# Altium schematic sheet Main.SchDoc
size C; DocumentNumber: 1; SheetNumber: 1; SheetTotal: 8
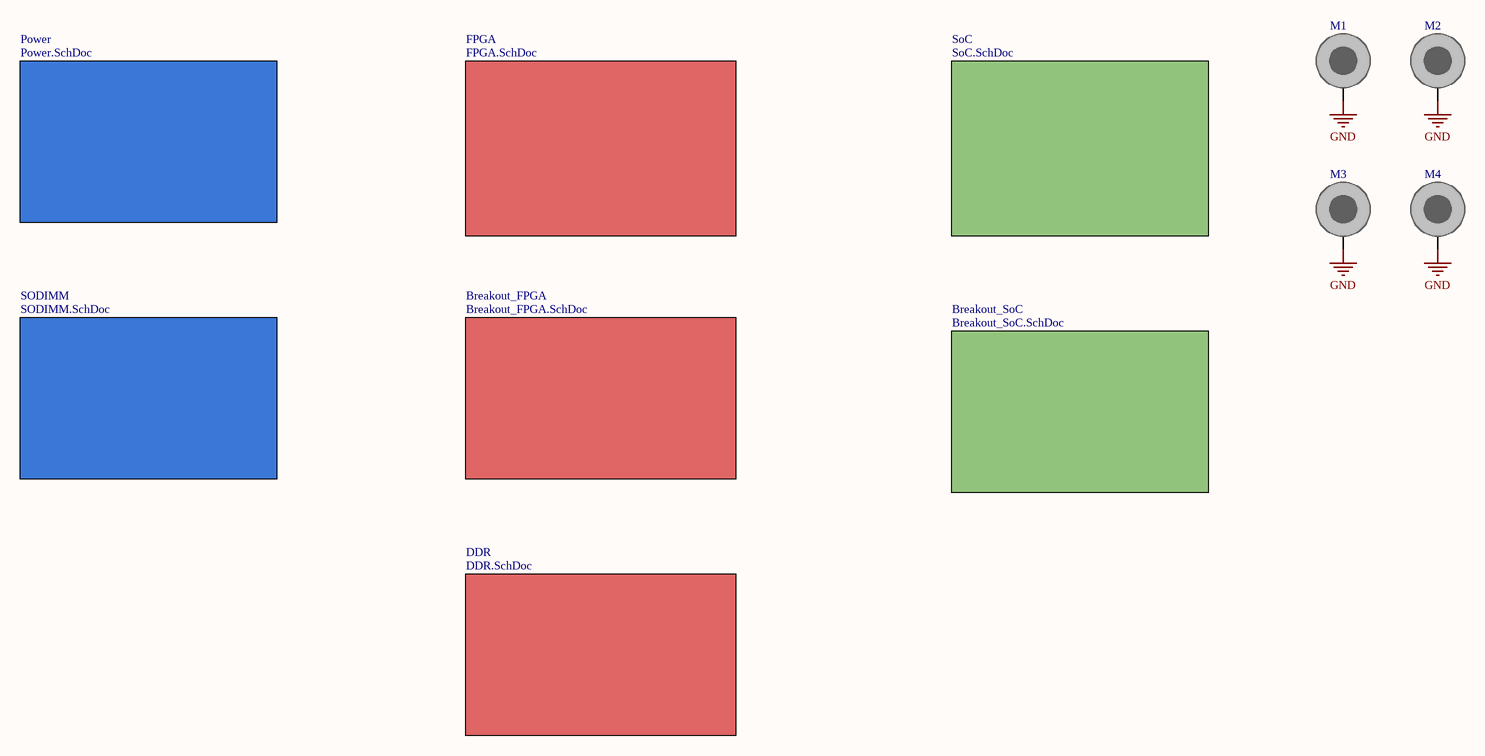
[diagram p0: Main.SchDoc]

## Parts
M1  DNP/MH  [SCH_M3]  (value not drawn)  (no BOM)
M2  DNP/MH  [SCH_M3]  (value not drawn)  (no BOM)
M3  DNP/MH  [SCH_M3]  (value not drawn)  (no BOM)
M4  DNP/MH  [SCH_M3]  (value not drawn)  (no BOM)

## Sub-sheets
Breakout_FPGA = Breakout_FPGA.SchDoc: no entries
Breakout_SoC = Breakout_SoC.SchDoc: no entries
DDR = DDR.SchDoc: no entries
FPGA = FPGA.SchDoc: no entries
Power = Power.SchDoc: no entries
SoC = SoC.SchDoc: no entries
SODIMM = SODIMM.SchDoc: no entries

## Nets
GND: M1.1 M2.1 M3.1 M4.1

## Library data of the parts
M1-M4 = SCMH_M3: SCREW mouting, M3, 3.0mm diameter and 6.0mm PanHead; ASSEMBLY: DNP; VALUE: DNP/MH